# Altium schematic sheet Sheet2.SchDoc
size 420 x 297 mm
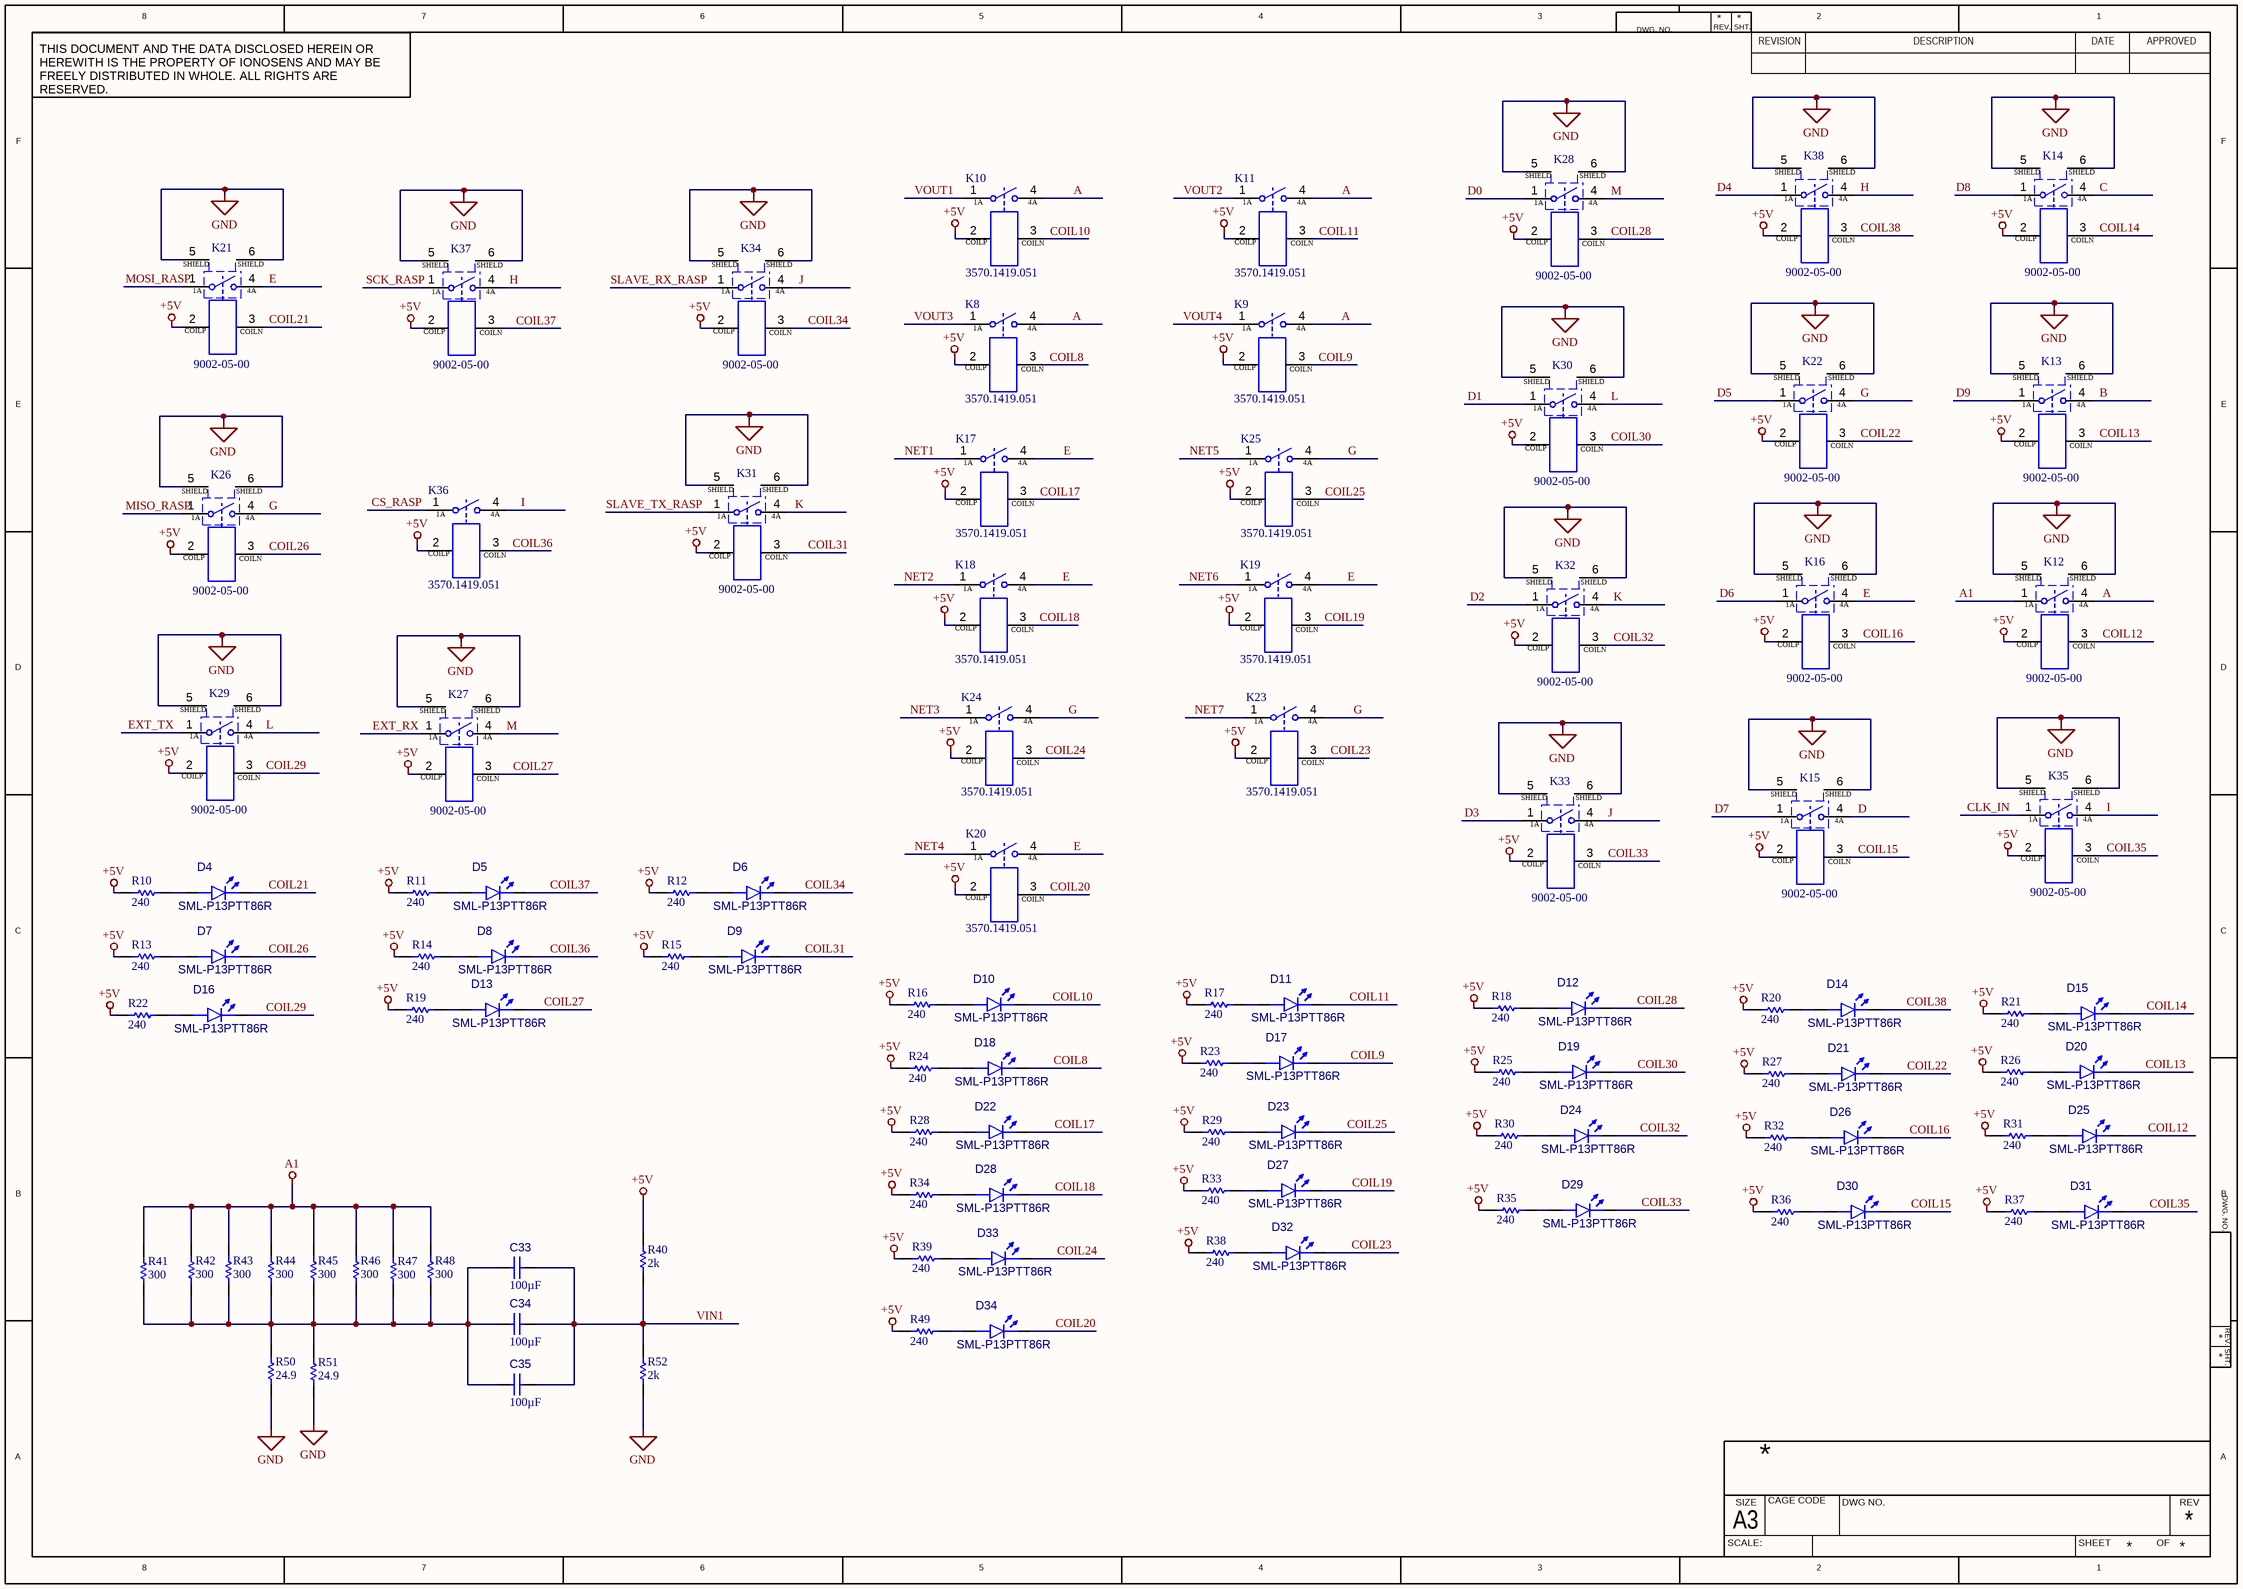
[diagram p0: Sheet2.SchDoc]

## Parts
C33  value 100µF  [CAPC3225X27M]  (hidden comment: EMK325ABJ107MM-P)
C34  value 100µF  [CAPC3225X27M]  (hidden comment: EMK325ABJ107MM-P)
C35  value 100µF  [CAPC3225X27M]  (hidden comment: EMK325ABJ107MM-P)
D4  SML-P13PTT86R  [DIOC1005X02R]
D5  SML-P13PTT86R  [DIOC1005X02R]
D6  SML-P13PTT86R  [DIOC1005X02R]
D7  SML-P13PTT86R  [DIOC1005X02R]
D8  SML-P13PTT86R  [DIOC1005X02R]
D9  SML-P13PTT86R  [DIOC1005X02R]
D10  SML-P13PTT86R  [DIOC1005X02R]
D11  SML-P13PTT86R  [DIOC1005X02R]
D12  SML-P13PTT86R  [DIOC1005X02R]
D13  SML-P13PTT86R  [DIOC1005X02R]
D14  SML-P13PTT86R  [DIOC1005X02R]
D15  SML-P13PTT86R  [DIOC1005X02R]
D16  SML-P13PTT86R  [DIOC1005X02R]
D17  SML-P13PTT86R  [DIOC1005X02R]
D18  SML-P13PTT86R  [DIOC1005X02R]
D19  SML-P13PTT86R  [DIOC1005X02R]
D20  SML-P13PTT86R  [DIOC1005X02R]
D21  SML-P13PTT86R  [DIOC1005X02R]
D22  SML-P13PTT86R  [DIOC1005X02R]
D23  SML-P13PTT86R  [DIOC1005X02R]
D24  SML-P13PTT86R  [DIOC1005X02R]
D25  SML-P13PTT86R  [DIOC1005X02R]
D26  SML-P13PTT86R  [DIOC1005X02R]
D27  SML-P13PTT86R  [DIOC1005X02R]
D28  SML-P13PTT86R  [DIOC1005X02R]
D29  SML-P13PTT86R  [DIOC1005X02R]
D30  SML-P13PTT86R  [DIOC1005X02R]
D31  SML-P13PTT86R  [DIOC1005X02R]
D32  SML-P13PTT86R  [DIOC1005X02R]
D33  SML-P13PTT86R  [DIOC1005X02R]
D34  SML-P13PTT86R  [DIOC1005X02R]
K8  3570.1419.051  [3570.1419]
K9  3570.1419.051  [3570.1419]
K10  3570.1419.051  [3570.1419]
K11  3570.1419.051  [3570.1419]
K12  9002-05-00  [SIP564W40P254L1980H810Q6 - Cloned]
K13  9002-05-00  [SIP564W40P254L1980H810Q6 - Cloned]
K14  9002-05-00  [SIP564W40P254L1980H810Q6 - Cloned]
K15  9002-05-00  [SIP564W40P254L1980H810Q6 - Cloned]
K16  9002-05-00  [SIP564W40P254L1980H810Q6 - Cloned]
K17  3570.1419.051  [3570.1419]
K18  3570.1419.051  [3570.1419]
K19  3570.1419.051  [3570.1419]
K20  3570.1419.051  [3570.1419]
K21  9002-05-00  [SIP564W40P254L1980H810Q6 - Cloned]
K22  9002-05-00  [SIP564W40P254L1980H810Q6 - Cloned]
K23  3570.1419.051  [3570.1419]
K24  3570.1419.051  [3570.1419]
K25  3570.1419.051  [3570.1419]
K26  9002-05-00  [SIP564W40P254L1980H810Q6 - Cloned]
K27  9002-05-00  [SIP564W40P254L1980H810Q6 - Cloned]
K28  9002-05-00  [SIP564W40P254L1980H810Q6 - Cloned]
K29  9002-05-00  [SIP564W40P254L1980H810Q6 - Cloned]
K30  9002-05-00  [SIP564W40P254L1980H810Q6 - Cloned]
K31  9002-05-00  [SIP564W40P254L1980H810Q6 - Cloned]
K32  9002-05-00  [SIP564W40P254L1980H810Q6 - Cloned]
K33  9002-05-00  [SIP564W40P254L1980H810Q6 - Cloned]
K34  9002-05-00  [SIP564W40P254L1980H810Q6 - Cloned]
K35  9002-05-00  [SIP564W40P254L1980H810Q6 - Cloned]
K36  3570.1419.051  [3570.1419]
K37  9002-05-00  [SIP564W40P254L1980H810Q6 - Cloned]
K38  9002-05-00  [SIP564W40P254L1980H810Q6 - Cloned]
R10  value 240  [RESC1005X04M]  (hidden comment: AC0402FR-07240RL)
R11  value 240  [RESC1005X04M]  (hidden comment: AC0402FR-07240RL)
R12  value 240  [RESC1005X04M]  (hidden comment: AC0402FR-07240RL)
R13  value 240  [RESC1005X04M]  (hidden comment: AC0402FR-07240RL)
R14  value 240  [RESC1005X04M]  (hidden comment: AC0402FR-07240RL)
R15  value 240  [RESC1005X04M]  (hidden comment: AC0402FR-07240RL)
R16  value 240  [RESC1005X04M]  (hidden comment: AC0402FR-07240RL)
R17  value 240  [RESC1005X04M]  (hidden comment: AC0402FR-07240RL)
R18  value 240  [RESC1005X04M]  (hidden comment: AC0402FR-07240RL)
R19  value 240  [RESC1005X04M]  (hidden comment: AC0402FR-07240RL)
R20  value 240  [RESC1005X04M]  (hidden comment: AC0402FR-07240RL)
R21  value 240  [RESC1005X04M]  (hidden comment: AC0402FR-07240RL)
R22  value 240  [RESC1005X04M]  (hidden comment: AC0402FR-07240RL)
R23  value 240  [RESC1005X04M]  (hidden comment: AC0402FR-07240RL)
R24  value 240  [RESC1005X04M]  (hidden comment: AC0402FR-07240RL)
R25  value 240  [RESC1005X04M]  (hidden comment: AC0402FR-07240RL)
R26  value 240  [RESC1005X04M]  (hidden comment: AC0402FR-07240RL)
R27  value 240  [RESC1005X04M]  (hidden comment: AC0402FR-07240RL)
R28  value 240  [RESC1005X04M]  (hidden comment: AC0402FR-07240RL)
R29  value 240  [RESC1005X04M]  (hidden comment: AC0402FR-07240RL)
R30  value 240  [RESC1005X04M]  (hidden comment: AC0402FR-07240RL)
R31  value 240  [RESC1005X04M]  (hidden comment: AC0402FR-07240RL)
R32  value 240  [RESC1005X04M]  (hidden comment: AC0402FR-07240RL)
R33  value 240  [RESC1005X04M]  (hidden comment: AC0402FR-07240RL)
R34  value 240  [RESC1005X04M]  (hidden comment: AC0402FR-07240RL)
R35  value 240  [RESC1005X04M]  (hidden comment: AC0402FR-07240RL)
R36  value 240  [RESC1005X04M]  (hidden comment: AC0402FR-07240RL)
R37  value 240  [RESC1005X04M]  (hidden comment: AC0402FR-07240RL)
R38  value 240  [RESC1005X04M]  (hidden comment: AC0402FR-07240RL)
R39  value 240  [RESC1005X04M]  (hidden comment: AC0402FR-07240RL)
R40  value 2k  [RESC1005X04M]  (hidden comment: AC0402FR-072KL)
R41  value 300  [RESC3116X06M]  (hidden comment: AC1206FR-07300RL)
R42  value 300  [RESC3116X06M]  (hidden comment: AC1206FR-07300RL)
R43  value 300  [RESC3116X06M]  (hidden comment: AC1206FR-07300RL)
R44  value 300  [RESC3116X06M]  (hidden comment: AC1206FR-07300RL)
R45  value 300  [RESC3116X06M]  (hidden comment: AC1206FR-07300RL)
R46  value 300  [RESC3116X06M]  (hidden comment: AC1206FR-07300RL)
R47  value 300  [RESC3116X06M]  (hidden comment: AC1206FR-07300RL)
R48  value 300  [RESC3116X06M]  (hidden comment: AC1206FR-07300RL)
R49  value 240  [RESC1005X04M]  (hidden comment: AC0402FR-07240RL)
R50  value 24.9  [RESC3116X06M]  (hidden comment: AC1206FR-0724R9L)
R51  value 24.9  [RESC3116X06M]  (hidden comment: AC1206FR-0724R9L)
R52  value 2k  [RESC1005X04M]  (hidden comment: AC0402FR-072KL)

## Nets
+5V: K8.2(COILP) K9.2(COILP) K10.2(COILP) K11.2(COILP) K12.2(COILP) K13.2(COILP) K14.2(COILP) K15.2(COILP) K16.2(COILP) K17.2(COILP) K18.2(COILP) K19.2(COILP) K20.2(COILP) K21.2(COILP) K22.2(COILP) K23.2(COILP) K24.2(COILP) K25.2(COILP) K26.2(COILP) K27.2(COILP) K28.2(COILP) K29.2(COILP) K30.2(COILP) K31.2(COILP) K32.2(COILP) K33.2(COILP) K34.2(COILP) K35.2(COILP) K36.2(COILP) K37.2(COILP) K38.2(COILP) R10.1 R11.1 R12.1 R13.1 R14.1 R15.1 R16.1 R17.1 R18.1 R19.1 R20.1 R21.1 R22.1 R23.1 R24.1 R25.1 R26.1 R27.1 R28.1 R29.1 R30.1 R31.1 R32.1 R33.1 R34.1 R35.1 R36.1 R37.1 R38.1 R39.1 R40.2 R49.1
A1: K12.1(1A) R41.2 R42.2 R43.2 R44.2 R45.2 R46.2 R47.2 R48.2
GND: K12.5(Shield) K12.6(Shield) K13.5(Shield) K13.6(Shield) K14.5(Shield) K14.6(Shield) K15.5(Shield) K15.6(Shield) K16.5(Shield) K16.6(Shield) K21.5(Shield) K21.6(Shield) K22.5(Shield) K22.6(Shield) K26.5(Shield) K26.6(Shield) K27.5(Shield) K27.6(Shield) K28.5(Shield) K28.6(Shield) K29.5(Shield) K29.6(Shield) K30.5(Shield) K30.6(Shield) K31.5(Shield) K31.6(Shield) K32.5(Shield) K32.6(Shield) K33.5(Shield) K33.6(Shield) K34.5(Shield) K34.6(Shield) K35.5(Shield) K35.6(Shield) K37.5(Shield) K37.6(Shield) K38.5(Shield) K38.6(Shield) R50.1 R51.1 R52.1
A: K8.4(4A) K9.4(4A) K10.4(4A) K11.4(4A) K12.4(4A)
B: K13.4(4A)
C: K14.4(4A)
CLK_IN: K35.1(1A)
COIL8: D18.1(K) K8.3(COILN)
COIL9: D17.1(K) K9.3(COILN)
COIL10: D10.1(K) K10.3(COILN)
COIL11: D11.1(K) K11.3(COILN)
COIL12: D25.1(K) K12.3(COILN)
COIL13: D20.1(K) K13.3(COILN)
COIL14: D15.1(K) K14.3(COILN)
COIL15: D30.1(K) K15.3(COILN)
COIL16: D26.1(K) K16.3(COILN)
COIL17: D22.1(K) K17.3(COILN)
COIL18: D28.1(K) K18.3(COILN)
COIL19: D27.1(K) K19.3(COILN)
COIL20: D34.1(K) K20.3(COILN)
COIL21: D4.1(K) K21.3(COILN)
COIL22: D21.1(K) K22.3(COILN)
COIL23: D32.1(K) K23.3(COILN)
COIL24: D33.1(K) K24.3(COILN)
COIL25: D23.1(K) K25.3(COILN)
COIL26: D7.1(K) K26.3(COILN)
COIL27: D13.1(K) K27.3(COILN)
COIL28: D12.1(K) K28.3(COILN)
COIL29: D16.1(K) K29.3(COILN)
COIL30: D19.1(K) K30.3(COILN)
COIL31: D9.1(K) K31.3(COILN)
COIL32: D24.1(K) K32.3(COILN)
COIL33: D29.1(K) K33.3(COILN)
COIL34: D6.1(K) K34.3(COILN)
COIL35: D31.1(K) K35.3(COILN)
COIL36: D8.1(K) K36.3(COILN)
COIL37: D5.1(K) K37.3(COILN)
COIL38: D14.1(K) K38.3(COILN)
CS_RASP: K36.1(1A)
D: K15.4(4A)
D0: K28.1(1A)
D1: K30.1(1A)
D2: K32.1(1A)
D3: K33.1(1A)
D4: K38.1(1A)
D5: K22.1(1A)
D6: K16.1(1A)
D7: K15.1(1A)
D8: K14.1(1A)
D9: K13.1(1A)
E: K16.4(4A) K17.4(4A) K18.4(4A) K19.4(4A) K20.4(4A) K21.4(4A)
EXT_RX: K27.1(1A)
EXT_TX: K29.1(1A)
G: K22.4(4A) K23.4(4A) K24.4(4A) K25.4(4A) K26.4(4A)
H: K37.4(4A) K38.4(4A)
I: K35.4(4A) K36.4(4A)
J: K33.4(4A) K34.4(4A)
K: K31.4(4A) K32.4(4A)
L: K29.4(4A) K30.4(4A)
M: K27.4(4A) K28.4(4A)
MISO_RASP: K26.1(1A)
MOSI_RASP: K21.1(1A)
NET1: K17.1(1A)
NET2: K18.1(1A)
NET3: K24.1(1A)
NET4: K20.1(1A)
NET5: K25.1(1A)
NET6: K19.1(1A)
NET7: K23.1(1A)
SCK_RASP: K37.1(1A)
SLAVE_RX_RASP: K34.1(1A)
SLAVE_TX_RASP: K31.1(1A)
VIN1: C33.2 C34.2 C35.2 R40.1 R52.2
VOUT1: K10.1(1A)
VOUT2: K11.1(1A)
VOUT3: K8.1(1A)
VOUT4: K9.1(1A)
NetC33_1: C33.1 C34.1 C35.1 R41.1 R42.1 R43.1 R44.1 R45.1 R46.1 R47.1 R48.1 R50.2 R51.2
NetD4_2: D4.2(A) R10.2
NetD5_2: D5.2(A) R11.2
NetD6_2: D6.2(A) R12.2
NetD7_2: D7.2(A) R13.2
NetD8_2: D8.2(A) R14.2
NetD9_2: D9.2(A) R15.2
NetD10_2: D10.2(A) R16.2
NetD11_2: D11.2(A) R17.2
NetD12_2: D12.2(A) R18.2
NetD13_2: D13.2(A) R19.2
NetD14_2: D14.2(A) R20.2
NetD15_2: D15.2(A) R21.2
NetD16_2: D16.2(A) R22.2
NetD17_2: D17.2(A) R23.2
NetD18_2: D18.2(A) R24.2
NetD19_2: D19.2(A) R25.2
NetD20_2: D20.2(A) R26.2
NetD21_2: D21.2(A) R27.2
NetD22_2: D22.2(A) R28.2
NetD23_2: D23.2(A) R29.2
NetD24_2: D24.2(A) R30.2
NetD25_2: D25.2(A) R31.2
NetD26_2: D26.2(A) R32.2
NetD27_2: D27.2(A) R33.2
NetD28_2: D28.2(A) R34.2
NetD29_2: D29.2(A) R35.2
NetD30_2: D30.2(A) R36.2
NetD31_2: D31.2(A) R37.2
NetD32_2: D32.2(A) R38.2
NetD33_2: D33.2(A) R39.2
NetD34_2: D34.2(A) R49.2

## Notes on the sheet
- 8
- 7
- 6
- 5
- 4
- 3
- DWG. NO.
- REV.
- SHT.
- REVISION
- 2
- DESCRIPTION
- DATE
- 1
- APPROVED
- THIS DOCUMENT AND THE DATA DISCLOSED HEREIN OR HEREWITH IS THE PROPERTY OF IONOSENS AND MAY BE FREELY DISTRIBUTED IN WHOLE. ALL RIGHTS ARE RESERVED.
- F
- E
- D
- C
- B
- A
- SCALE:
- A3
- SIZE
- CAGE CODE
- DWG NO.
- SHEET
- OF
- REV
- (in symbol K01-0008-01-00002-6) SHIELD

## Library data of the parts
C33-C35 = C01-0402-01-00002-1: Multilayer Ceramic Capacitors (High dielectric type), 16V, 100 uF, ± 20 %, 1210, X5R, RoHS; Manufacturer: Taiyo Yuden; Tolerance: 20%; Dielectric: XR5; Min Operating Temperature: -55°C; Voltage Rating (DC): 16V; Pins: 2; Composition: Ceramic; Mount: SMD; Manufacturer P/N: EMK325ABJ107MM-P; Capacitor Type: Multilayer Ceramic; Thickness: 2.2m; RoHS Compliant: Yes; Termination: -; Depth: 2.2m; Case/Package: 1210; Max Operating Temperature: 85°C; Voltage Rating: 16V; Length: 3.5m; Width: 2.8m; Mounting Technology: SMD
D4-D34 = D01-0402-01-00000-1: Led green 0402; Manufacturer: ROHM; Forward Voltage: 2.1V; Max Power Dissipation: 52mW; Forward Current: 20 mA; Number of LEDs: 1; Dominant Wavelength: 560 nm; Luminous Intensity: 10 mcd; Lens Style: Rectangular, Square; Min Operating Temperature: -40°C; Mounting Technology: SMD; Colour: Green; Manufacturer P/N: SML-P13PTT86R; Max Operating Temperature: 85°C; Pins: 2; RoHS Compliant: Yes; Case/Package: 0402
K8-K11 K17-K20 K23-K25 K36 = K01-0008-01-00008-1: Reed Relay, Mini SIP, 5 VDC; 1 Form A, 15W, 200 VDC, 1.25A; Manufacturer: Comus; Number of Terminal: 4; Contact Current Rating: 1A; Coil Current: 10mA; Switching Voltage: 200V; Rise time: 0s; Contact Resistence: 0.15; Coil resitence: 500; Operate Time: 350µs; Coil Voltage (DC): 5V; Insulation Resistance: 0; Release Time: 100µs; Manufacturer P/N: 3570.1419.051; Mounting Technology: TH; Contact Material: -; Relay Type: Reed; Width: 15.24mm; Contact Form: 1A; Packaging: SIP; Switching Current: 1A; Pins: 4; Case/Package: SIP; Coil Type: -; Min Operating Temperature: -40°C; RoHS: Yes; Height: 6.98mm; Max Operating Temperature: 85°C
K12-K16 K21 K22 K26-K35 K37 K38 = K01-0008-01-00002-6: Reed Relay 5VDC 350Ohm 0.5A SPST-NO THT; Manufacturer: COTO; Rise time: 350µs; Coil Current: 14.28mA; Release Time: 100µs; Number of Terminal: 6; Contact Form: SPST; Insulation Resistance: 1T; Coil Type: Non-Latching; Coil Voltage (DC): 5V; Contact Current Rating: 500mA; Contact Resistence: 0.2; Switching Voltage: 200V; Coil resitence: 350; Relay Type: RF; Mounting Technology: Through Hole; Case/Package: SIP; Contact Material: Ruthenium; Packaging: Bulk; Width: 19.3mm; Height: 7.6mm; Max Operating Temperature: 85°C; RoHS: Yes; Min Operating Temperature: -20°C; Pins: 6; Switching Current: 500mA; Operate Time: 350µs; Manufacturer P/N: 9002-05-00
R10-R39 R49 = R01-0402-01-00437-2: RES SMD 240 OHM 1% 1/16W 0402; Manufacturer: Yageo; Temperature Coefficient: 100 ppm/ºC; Power Rating: 62.5mW; Voltage Rating: 50V; Packaging: Tape & Reel; Manufacturer P/N: AC0402FR-07240RL; Height: 370µm; Case/Package: 0402; Composition: Thick Film; Max Operating Temperature: 155°C; Number of Terminations: 2; RoHS: Yes; Min Operating Temperature: -55°C; Tolerance: 1%; Width: 508µm; Length: 990.6µm; Features: Automotive AEC-Q200, Moisture Resistant
R40 R52 = R01-0402-01-00067-3: RES SMD 2K OHM 1% 1/16W 0402; Manufacturer: Yageo; Voltage Rating: 50V; Power Rating: 62.5mW; Temperature Coefficient: 100 ppm/ºC; Tolerance: 1%; Length: 990.6µm; Width: 508µm; Number of Terminations: 2; Packaging: Tape & Reel; Composition: Thick Film; RoHS: Yes; Height: 370µm; Case/Package: 0402; Manufacturer P/N: AC0402FR-072KL; Features: Automotive AEC-Q200, Moisture Resistant; Min Operating Temperature: -55°C; Max Operating Temperature: 155°C
R41-R48 = R01-1206-01-00248-1: RES SMD 300 OHM 1% 1/4W 1206; Manufacturer: Yageo; Temperature Coefficient: 100 ppm/ºC; Voltage Rating: 150V; Power Rating: 250mW; Number of Terminations: 2; Height: 650µm; Min Operating Temperature: -55°C; Composition: Thick Film; Packaging: Tape & Reel; Length: 3.0988mm; Width: 1.6002mm; Case/Package: 1206; Tolerance: 1%; RoHS: Yes; Features: Automotive AEC-Q200, Moisture Resistant; Max Operating Temperature: 155°C; Manufacturer P/N: AC1206FR-07300RL
R50 R51 = R01-1206-01-00129-1: RES SMD 24.9 OHM 1% 1/4W 1206; Manufacturer: Yageo; Voltage Rating: 150V; Temperature Coefficient: 100 ppm/ºC; Power Rating: 250mW; Max Operating Temperature: 155°C; Length: 3.0988mm; Width: 1.6002mm; Height: 650µm; Features: Automotive AEC-Q200, Moisture Resistant; Packaging: Tape & Reel; Min Operating Temperature: -55°C; Manufacturer P/N: AC1206FR-0724R9L; Tolerance: 1%; Case/Package: 1206; Composition: Thick Film; RoHS: Yes; Number of Terminations: 2